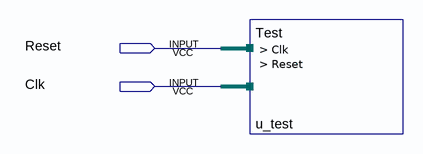
[diagram p0: schematic sheet]
// Quartus schematic Test.bdf as structural Verilog: 1 symbols, 2 pins
module Test (
  input  Reset,
  input  Clk
);

  Test u_test (.Clk(Clk), .Reset(Reset));
endmodule
